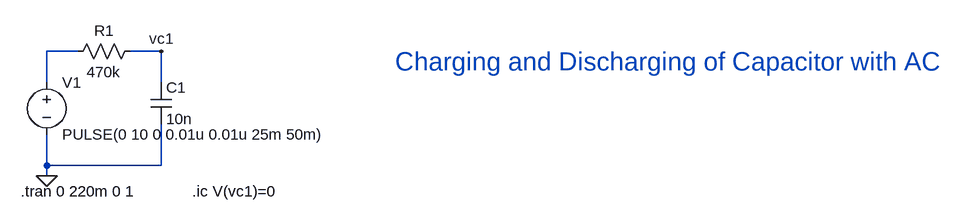
[diagram p0: schematic RC_via_AC.asc]
RC_via_AC.asc, the LTspice schematic file:
Version 4.1
SHEET 1 1192 680
WIRE -208 64 -256 64
WIRE -80 64 -128 64
WIRE -256 112 -256 64
WIRE -80 112 -80 64
WIRE -256 240 -256 192
WIRE -80 240 -80 176
WIRE -80 240 -256 240
WIRE -256 256 -256 240
FLAG -256 256 0
FLAG -80 64 vc1
SYMBOL voltage -256 96 R0
WINDOW 123 0 0 Left 0
WINDOW 39 0 0 Left 0
SYMATTR InstName V1
SYMATTR Value PULSE(0 10 0 0.01u 0.01u 25m 50m)
SYMBOL res -112 48 R90
WINDOW 0 0 56 VBottom 2
WINDOW 3 32 56 VTop 2
SYMATTR InstName R1
SYMATTR Value 470k
SYMBOL cap -96 112 R0
SYMATTR InstName C1
SYMATTR Value 10n
SYMATTR SpiceLine V=50
TEXT -296 280 Left 2 !.tran 0 220m 0 1
TEXT -32 280 Left 2 !.ic V(vc1)=0
TEXT 280 80 Left 4 ;Charging and Discharging of Capacitor with AC

The netlist it stands for:
* RC_via_AC.asc
V1 N001 0 PULSE(0 10 0 0.01u 0.01u 25m 50m)
R1 vc1 N001 470k
C1 vc1 0 10n V=50
.tran 0 220m 0 1
.ic V(vc1)=0
* Charging and Discharging of Capacitor with AC
.backanno
.end